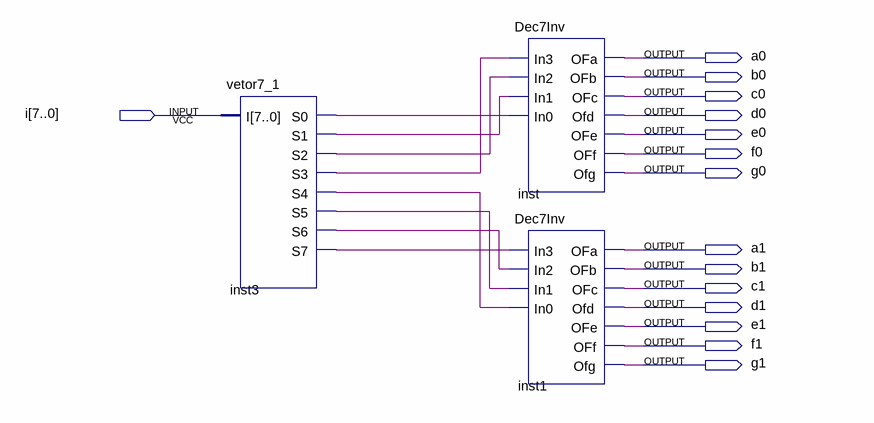
[diagram p0: schematic sheet]
// Quartus schematic disp7x2.bdf as structural Verilog: 3 symbols, 15 pins
module disp7x2 (
  input  [7:0] i,
  output a0,
  output b0,
  output c0,
  output d0,
  output e0,
  output f0,
  output g0,
  output a1,
  output b1,
  output c1,
  output d1,
  output e1,
  output f1,
  output g1
);

  wire inst3_s0, inst3_s1, inst3_s2, inst3_s3, inst3_s4, inst3_s5, inst3_s6, inst3_s7;

  vetor7_1 inst3 (
    .I(i), .S0(inst3_s0), .S1(inst3_s1), .S2(inst3_s2), .S3(inst3_s3), .S4(inst3_s4), .S5(inst3_s5),
    .S6(inst3_s6), .S7(inst3_s7));
  Dec7Inv inst (
    .In3(inst3_s3), .In2(inst3_s2), .In1(inst3_s1), .In0(inst3_s0), .OFa(a0), .OFb(b0), .OFc(c0), .Ofd(d0),
    .OFe(e0), .OFf(f0), .Ofg(g0));
  Dec7Inv inst1 (
    .In3(inst3_s7), .In2(inst3_s6), .In1(inst3_s5), .In0(inst3_s4), .OFa(a1), .OFb(b1), .OFc(c1), .Ofd(d1),
    .OFe(e1), .OFf(f1), .Ofg(g1));
endmodule
